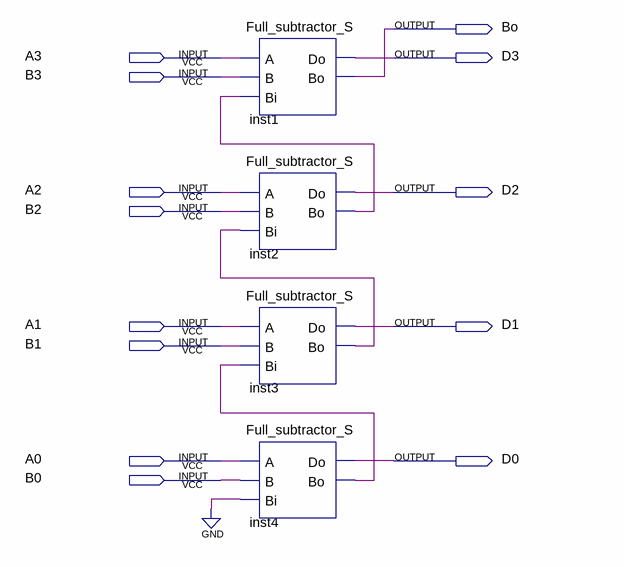
[diagram p0: schematic sheet]
// Quartus schematic 4bit_subtracor.bdf as structural Verilog: 4 symbols, 13 pins
module \4bit_subtracor  (
  input  A3,
  input  B3,
  input  A2,
  input  B2,
  input  A1,
  input  B1,
  input  A0,
  input  B0,
  output Bo,
  output D3,
  output D2,
  output D1,
  output D0
);

  wire inst2_bo, inst3_bo, inst4_bo;

  Full_subtractor_S inst1 (.A(A3), .B(B3), .Bi(inst2_bo), .Do(D3), .Bo(Bo));
  Full_subtractor_S inst2 (.A(A2), .B(B2), .Bi(inst3_bo), .Do(D2), .Bo(inst2_bo));
  Full_subtractor_S inst3 (.A(A1), .B(B1), .Bi(inst4_bo), .Do(D1), .Bo(inst3_bo));
  Full_subtractor_S inst4 (.A(A0), .B(B0), .Bi(1'b0), .Do(D0), .Bo(inst4_bo));
endmodule
